# EAGLE design AEMBLINK-R1 (EAGLE 9.3.2)
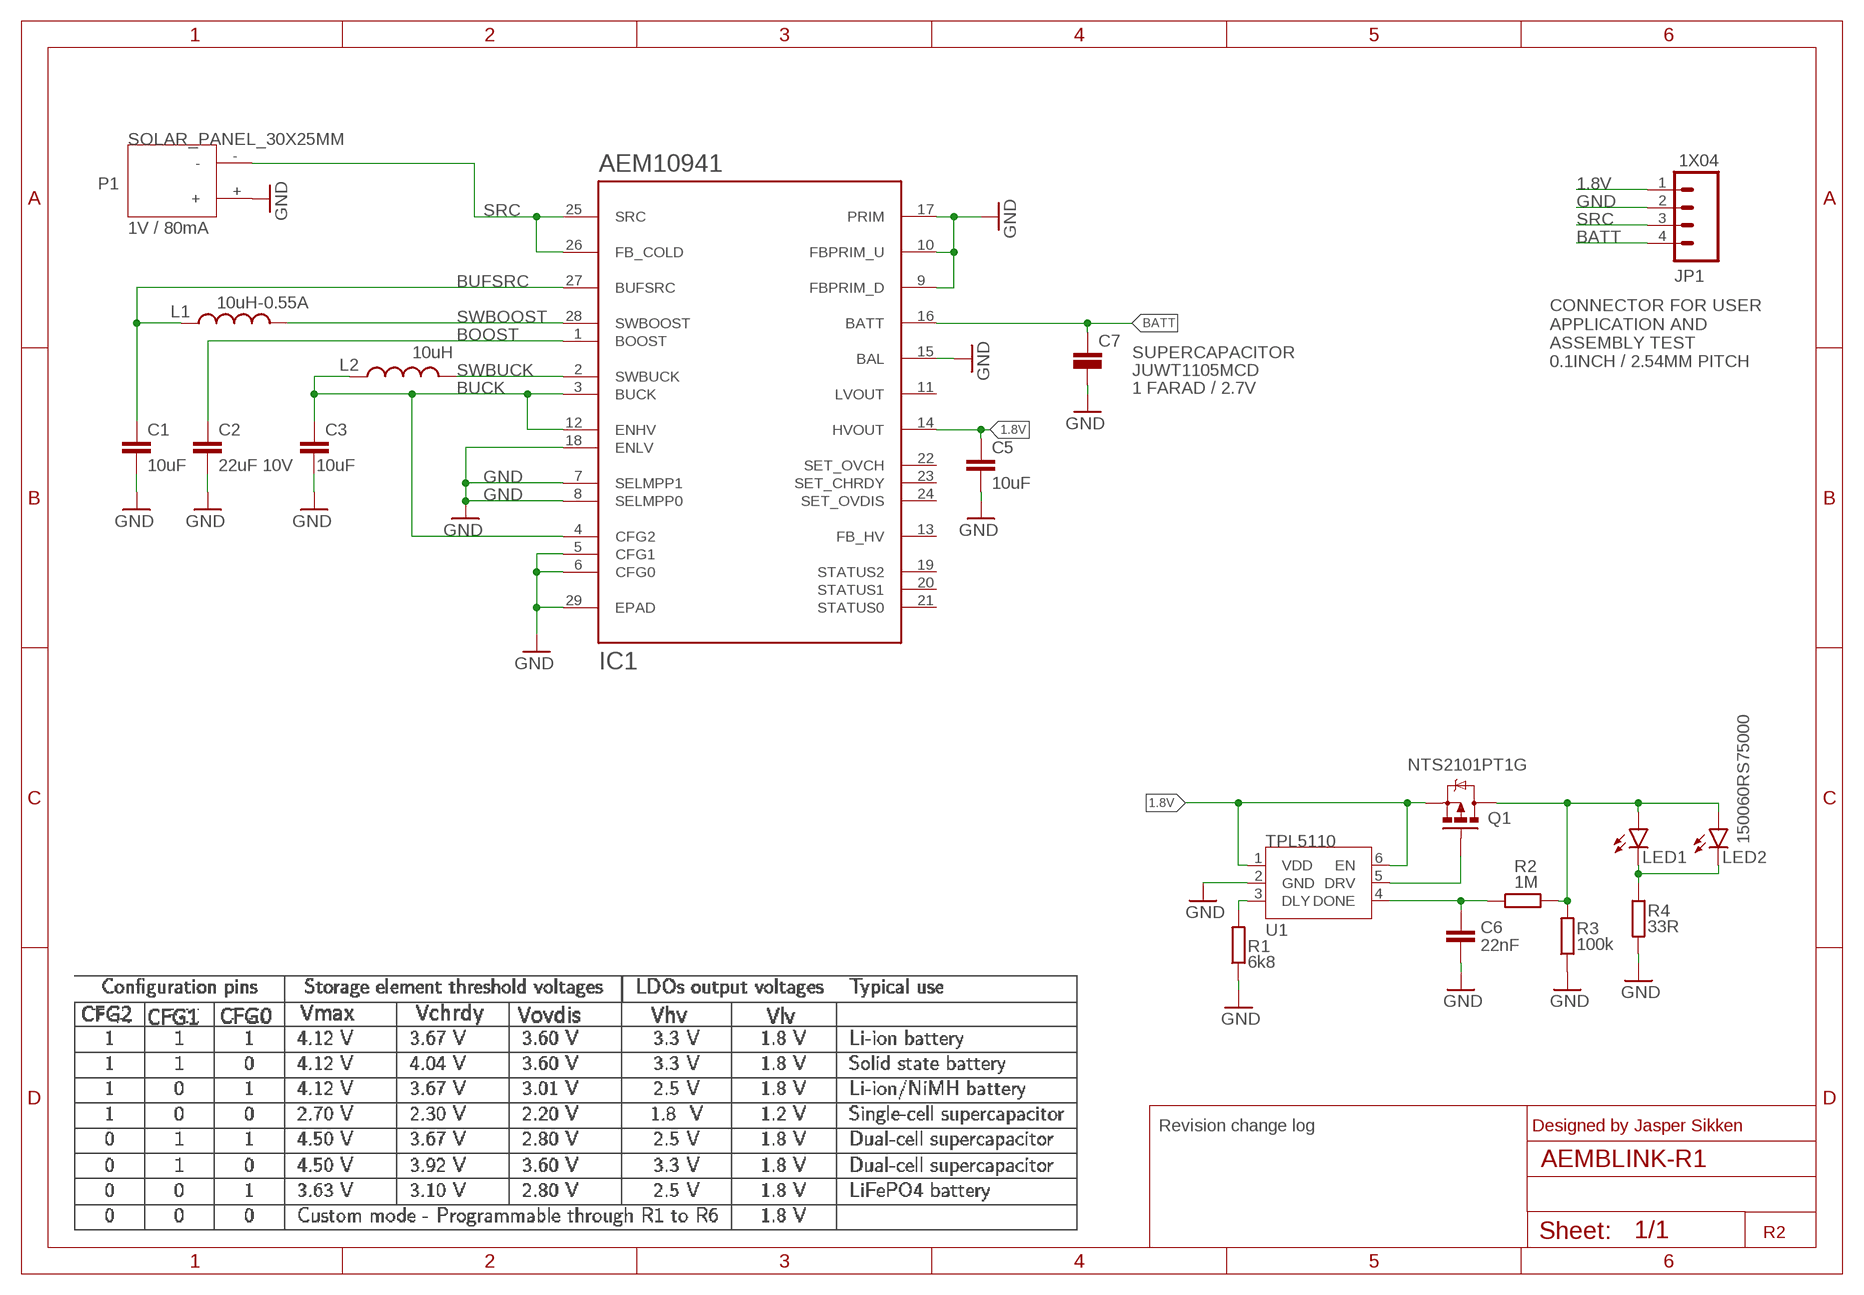
[diagram p0: schematic, sheet 1]

## Parts
C1  10uF  C0603_10UF  [C0603]
C2  22uF 10V  C0603_22UF  [C0603]
C3  10uF  C0603_10UF  [C0603]
C5  10uF  C0603_10UF  [C0603]
C6  22nF  C0603_10NF  [C0603]
C7  JUWT1105MCD  SUPERCAPNICHICON  [C_RADIAL_9L6.3D2.5P0.5H_HOR]
IC1  AEM10941  [QFN50P505X505X90-28]
JP1  1X04  [1X04_2.54MM_ROUND_NOSILK]
L1  10uH-0.55A  L3.9X3.9_10UH_0.55A  [LPS4012]
L2  10uH  L0603_10UH  [L0603]
LED1  LEDCHIPLED_0603  [CHIPLED_0603]
LED2  150060RS75000  LEDCHIPLED_0603  [CHIPLED_0603]
P1  SOLAR_PANEL_30X25MM  [SOLAR_PANEL_30X25]
Q1  NTS2101PT1G  MOSFET-P-CHANNEL-DMP2160UW  [SOT323]
R1  6k8  R-EU_R0603  [R0603]
R2  1M  R0603_1M  [R0603]
R3  100k  R0603_1M  [R0603]
R4  33R  R-EU_R0603  [R0603]
U1  TPL5110  [SOT23-6]

## Nets
1.8V: C5.1 IC1.14(HVOUT) JP1.1 Q1.2(S) U1.1(VDD) U1.6(EN)
BATT: C7.+ IC1.16(BATT) JP1.4
BOOST: C2.1 IC1.1(BOOST)
BUCK: C3.1 IC1.3(BUCK) IC1.4(CFG2) IC1.12(ENHV) L2.1
BUFSRC: C1.1 IC1.27(BUFSRC) L1.1
DELAY: R1.2 U1.3(DLY)
DONE: C6.1 R2.1 U1.4(DONE)
DRIVE: Q1.1(G) U1.5(DRV)
GND: C1.2 C2.2 C3.2 C5.2 C6.2 C7.- IC1.5(CFG1) IC1.6(CFG0) IC1.7(SELMPP1) IC1.8(SELMPP0) IC1.9(FBPRIM_D) IC1.10(FBPRIM_U) IC1.15(BAL) IC1.17(PRIM) IC1.18(ENLV) IC1.29(EPAD) JP1.2 P1.+ R1.1 R3.1 R4.2 U1.2(GND)
LEDNET: LED1.C LED2.C R4.1
N$5: LED1.A LED2.A Q1.3(D) R2.2 R3.2
SRC: IC1.25(SRC) IC1.26(FB_COLD) JP1.3 P1.-
SWBOOST: IC1.28(SWBOOST) L1.2
SWBUCK: IC1.2(SWBUCK) L2.2
Unconnected: IC1.11(LVOUT) IC1.13(FB_HV) IC1.19(STATUS2) IC1.20(STATUS1) IC1.21(STATUS0) IC1.22(SET_OVCH) IC1.23(SET_CHRDY) IC1.24(SET_OVDIS)

## Notes on the sheet
- 1V / 80mA
- SUPERCAPACITOR
- CONNECTOR FOR USER 
  APPLICATION AND 
  ASSEMBLY TEST
  0.1INCH / 2.54MM PITCH
- 1 FARAD / 2.7V
- Revision change log | Designed by Jasper Sikken
- R2

## Library data of the parts
C1 C3 C5 = TSEM:C: Non-polarized capacitor; FARNELL_OC: 2113070; MF: Taiyo Yuden; MPN: LMK107BBJ106MALT
C2 = TSEM:C: Non-polarized capacitor; FARNELL_OC: 2426957; MF: Murata; MPN: GRM188R61A226ME15D
C6 = TSEM:C: Non-polarized capacitor; FARNELL_OC: 3019561
C7 = TSEM:SUPERCAP
IC1 = TSEM:AEM10941: Ambient Energy Manager from e-peas; MF: e-peas; MPN: AEM10941
JP1 = TSEM:1X04
L1 = TSEM:L: Inductor; FARNELL_OC: 2408076; MF: Coilcraft; MPN: LPS4012-103MRB
L2 = TSEM:L: Inductor; FARNELL_OC: 2215635; MF: TDK; MPN: MLZ1608M100WT
LED1 LED2 = led:LED: LED OSRAM: - CHIPLED LG R971, LG N971, LY N971, LG Q971, LY Q971, LO R971, LY R971 LH N974, LH R974 LS Q976, LO Q976, LY Q976 LO Q996 - Hyper CHIPLED LW Q18S LB Q993, LB Q99A, LB R99A - SideLED LS A670, LO A670, LY A670, LG A670, LP A670 LB A673, LV A673, LT A673, LW A673 LH A674 LY A675 LS A676, LA A676, LO A676, LY A676, LW A676 LS A679, LY A679, LG A679 - Hyper Micro SIDELED® LS Y876, LA Y876, LO Y876, LY Y876 LT Y87S - SmartLED LW L88C, LW L88S LB L89C, LB L89S, LG L890 LS L89K, LO L89K, LY L89K LS L896, LA L896, LO L896, LY L896 - TOPLED LS T670, LO T670, LY T670, LG T670, LP T670 LSG T670, LSP T670, LSY T670, LOP T670, LYG T670 LG T671, LOG T671, LSG T671 LB T673, LV T673, LT T673, LW T673 LH T674 LS T676, LA T676, LO T676, LY T676, LB T676, LH T676, LSB T676, LW T676 LB T67C, LV T67C, LT T67C, LS T67K, LO T67K, LY T67K, LW E67C LS E67B, LA E67B, LO E67B, LY E67B, LB E67C, LV E67C, LT E67C LW T67C LS T679, LY T679, LG T679 LS T770, LO T770, LY T770, LG T770, LP T770 LB T773, LV T773, LT T773, LW T773 LH T774 LS E675, LA E675, LY E675, LS T675 LS T776, LA T776, LO T776, LY T776, LB T776 LHGB T686 LT T68C, LB T68C - Hyper Mini TOPLED® LB M676 - Mini TOPLED Santana® LG M470 LS M47K, LO M47K, LY M47K Source: http://www.osram.convergy.de LUXEON: - LUMILED® LXK2-PW12-R00, LXK2-PW12-S00, LXK2-PW14-U00, LXK2-PW14-V00 LXK2-PM12-R00, LXK2-PM12-S00, LXK2-PM14-U00 LXK2-PE12-Q00, LXK2-PE12-R00, LXK2-PE12-S00, LXK2-PE14-T00, LXK2-PE14-U00 LXK2-PB12-K00, LXK2-PB12-L00, LXK2-PB12-M00, LXK2-PB14-N00, LXK2-PB14-P00, LXK2-PB14-Q00 LXK2-PR12-L00, LXK2-PR12-M00, LXK2-PR14-Q00, LXK2-PR14-R00 LXK2-PD12-Q00, LXK2-PD12-R00, LXK2-PD12-S00 LXK2-PH12-R00, LXK2-PH12-S00 LXK2-PL12-P00, LXK2-PL12-Q00, LXK2-PL12-R00 Source: www.luxeon.com KINGBRIGHT: KA-3528ASYC Source: www.kingbright.com
P1 = TSEM:SOLAR_PANEL_30X25MM
Q1 = TSEM:MOSFET-P-CHANNEL: MOSFET P Channel; FARNELL_OC: 1858672
R1 R4 = rcl:R-EU_: RESISTOR, European symbol; SPICEPREFIX: R
R2 = TSEM:R: Resistor; FARNELL_OC: 2447285
R3 = TSEM:R: Resistor; FARNELL_OC: 2447285; VALUE: 1M
U1 = TSEM:TPL5110: TPL5110 Nano-Power System Timer for Power Gating SOT23 (6) 3.00 mm × 3.00 mm

## Board
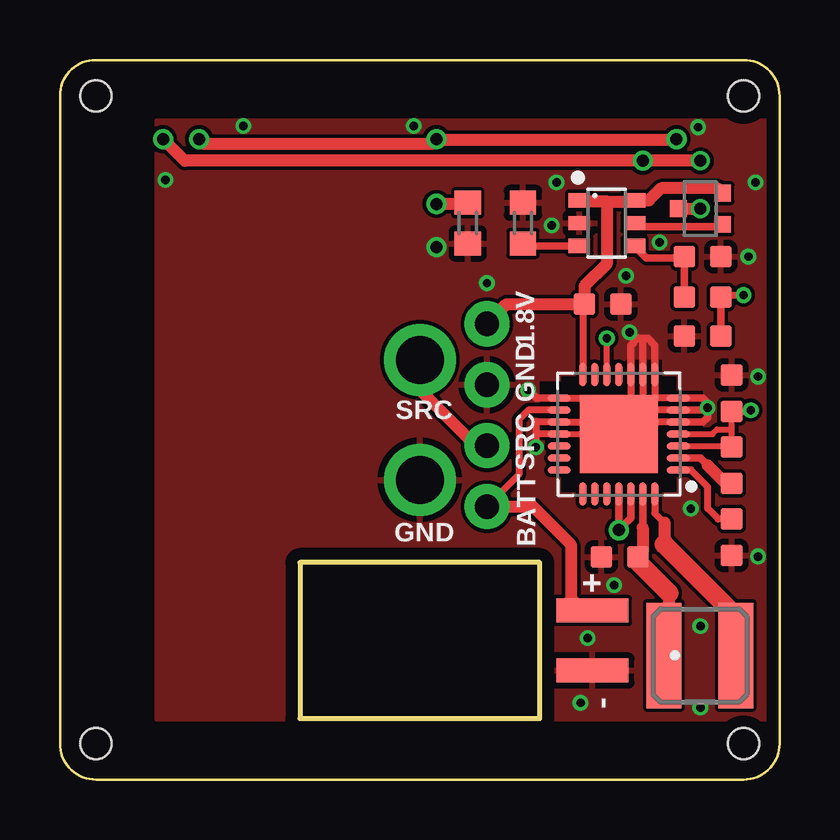
[diagram p1: board, top side]
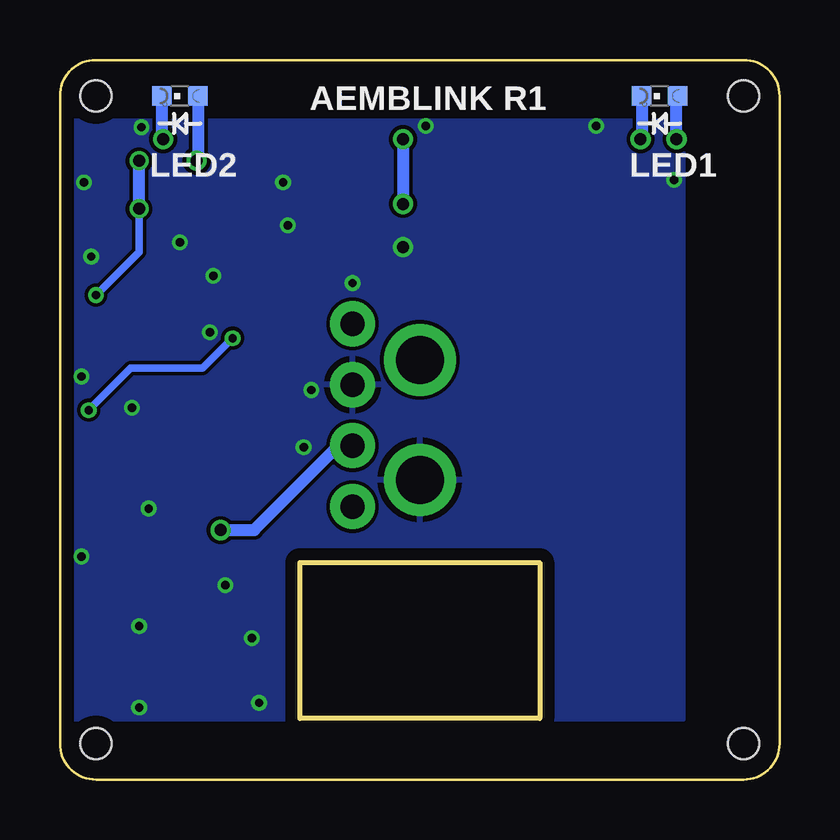
[diagram p2: board, bottom side, seen from below]

Size 30 x 30 mm. Coordinates in mm from the lower left corner, seen from the top.
Outline: 1.5,30 9,30 21,30 28.5,30 arc-90 30,28.5 30,1.5 arc-90 28.5,0 1.5,0 arc-90 0,1.5 0,28.5 arc-90 1.5,30
Copper layers (1*16): Top 0.035mm / dielectric 1.6mm / Bottom 0.035mm
Design rules "Elecrow_2-layer_PCB_eagle_rule *": minimum track width 6mil, minimum drill 12mil, track to track 0.15mm, track to pad 0.15mm, pad to pad 0.15mm, via to via 0.15mm, smd to smd 0mil, copper to edge 20mil, drill to drill 10mil, minimum pad ring 6mil, minimum via ring 6mil, stop-mask expansion 0.05mm, vias tented up to drill 100mil, thermal gap 10mil
Holes 1.3 mm at 1.5,28.5 28.5,28.5 1.5,1.5 28.5,1.5
tRestrict: area 23.6,16.5 to 25.1,17.5; area 25.4,14.7 to 26.8,16.2; area 20,15.7 to 21.3,16.6; area 19.9,14.2 to 21.1,15.1

### Footprints (pad centres in the part's own frame; a part is rotated, then mirrored left to right if it is on the bottom)
C0603 = smd 0.889 x 0.889: 1 -0.762,0; 2 0.762,0
C_RADIAL_9L6.3D2.5P0.5H_HOR = smd 1 x 3: + -1.25,7.2; - 1.25,7.2
QFN50P505X505X90-28 = smd 0.977 x 0.292: 1 -2.486,1.5; 2 -2.486,1; 3 -2.486,0.5; 4 -2.486,0; 5 -2.486,-0.5; 6 -2.486,-1; 7 -2.486,-1.5; 15 2.486,-1.5; 16 2.486,-1; 17 2.486,-0.5; 18 2.486,0; 19 2.486,0.5; 20 2.486,1; 21 2.486,1.5 | smd 0.292 x 0.977: 8 -1.5,-2.486; 9 -1,-2.486; 10 -0.5,-2.486; 11 0,-2.486; 12 0.5,-2.486; 13 1,-2.486; 14 1.5,-2.486; 22 1.5,2.486; 23 1,2.486; 24 0.5,2.486; 25 0,2.486; 26 -0.5,2.486; 27 -1,2.486; 28 -1.5,2.486 | smd 3.25 x 3.25: 29 0,0
1X04_2.54MM_ROUND_NOSILK = drill 1.016 pad 1.88: 1 0,0; 2 2.54,0; 3 5.08,0; 4 7.62,0
LPS4012 = smd 1.45 x 4.4: 1 -1.5,0; 2 1.5,0
L0603 = smd 0.889 x 0.889: 1 -0.762,0; 2 0.762,0
CHIPLED_0603 = smd 0.8 x 0.8: A 0,-0.75; C 0,0.75
SOLAR_PANEL_30X25 = drill 2 pad 3: + -2.5,0; - 2.5,0
SOT323 = smd 0.7 x 0.7: 1 -0.65,-0.925; 2 0.65,-0.925; 3 0,0.925
R0603 = smd 1 x 1.1: 1 -0.85,0; 2 0.85,0
R0603' = smd 0.889 x 0.889: 1 -0.762,0; 2 0.762,0
SOT23-6 = smd 0.6 x 0.9: 1 -0.95,-1.15; 2 0,-1.15; 3 0.95,-1.15; 4 0.95,1.15; 5 0,1.15; 6 -0.95,1.15

### Placement (x,y rotation side)
C1  23.33,9.28 180 top
C2  28,10.1 270 top
C3  28,16.1 90 top
C5  22.63,19.82 0 top
C6  26.8,21.8 0 top
C7  15,5.8 270 top
IC1  23.3,14.4 180 top
JP1  17.8,19 270 top
L1  26.68,5.17 0 top
L2  28,13.1 270 top
LED1  5,28.5 90 bottom
LED2  25,28.5 90 bottom
P1  15,15 90 top
Q1  26.7,23.8 90 top
R1  19.3,23.2 270 top
R2  1M  [R0603']  26.8,20.12 0 top
R3  100k  [R0603']  26.8,18.5 0 top
R4  17,23.2 270 top
U1  22.8,23.2 270 top

### Tracks (layer width: path | path; a pad name or v marks a point on that pad's centre or on a via)
1.8V
  Top 0.3: C5.1 21.8,19.75 IC1.14
  Top 0.305: 21.5,24.2 21.6,24.2 U1.1
  Top 0.5: 22.8,24.1 22.8,21.5 21.87,20.57 C5.1 18.62,19.82 JP1.1 | 22.8,24.1 23.9,24.1 U1.6 24.56,24.15 25.06,24.65 27.42,24.65 Q1.2 | 22.8,24.1 21.6,24.1 21.5,24.2
BATT
  Top 0.3: IC1.16 19.53,15.4 19.13,15 19.13,12.71 JP1.4 | 21.8,7.05 C7.+
  Top 0.5: JP1.4 19.72,11.38 21.3,9.8 21.3,7.55 21.8,7.05
BOOST
  Top 0.3: C2.1 27.44,10.86 27,11.3 27,12.2 26.3,12.9
  Top 0.305: 26.3,12.9 IC1.1
BUCK  (via drill 0.35)
  Top 0.254: IC1.12 v22.8,18.4 | L2.1 28,14.6 | 28,14.6 C3.1 | IC1.4 27.2,14.4 27.4,14.6 28,14.6 | IC1.3 27.96,13.9
  Top 0.305: 27.96,13.9 L2.1 | C3.1 28.74,15.34 v28.8,15.4
  Bottom 0.305: v28.8,15.4 27.05,17.15 24.05,17.15 v22.8,18.4
BUFSRC
  Top 0.305: IC1.27 24.3,10.5
  Top 0.508: 24.3,10.5 24.3,9.48 C1.1 24.1,9.07 | 25.4,7.78 25.4,5.39 L1.1
  Top 0.8: 25.4,7.78 24.1,9.07
DELAY
  Top 0.305: U1.3 19.4,22.25 R1.2
DONE
  Top 0.305: U1.4 24.45,21.75 25.99,21.75 C6.1 R2.1
DRIVE
  Top 0.305: U1.5 24.1,23.05 27.52,23.05 Q1.1
GND  (via drill 0.35, 0.5 pad 0.85)
  Top 0.254: IC1.18 23.2,14.4
  Top 0.3: IC1.5 24.9,14.9 24.3,14.3 23.4,14.3 IC1.29 | IC1.6 24.3,15.4 | IC1.7 24.8,15.9 | 24.8,15.9 24.3,15.4 | IC1.8 24.8,15.9 | IC1.9 24.3,15.4 | 24.3,15.4 23.8,14.9 | IC1.10 23.8,14.9 | IC1.29 23.2,14.4 22.7,14.9 IC1.17 19.86,14.9 19.84,14.92 19.84,14.37 | IC1.29 23.5,14.6 | 23.5,14.6 23.8,14.9 | IC1.15 22.2,15.9 23.5,14.6 | IC1.18 19.87,14.4 19.84,14.37 | 19.84,14.37 v19.84,13.85
  Top 0.305: IC1.5 26.8,14.9 27,15.1 v27,15.5 | IC1.6 26.9,15.4 v27,15.5 | IC1.7 26.8,15.9 27,15.7 v27,15.5 | IC1.10 23.8,18.1 24.1,18.4 24.3,18.4 | IC1.9 24.3,18.4 | IC1.8 24.8,18.1 24.5,18.4 24.3,18.4 | IC1.15 19.86,15.9 v19.52,16.24
  other vias: 26.7,6.4 29.1,16.8 23.1,8.1 26.3,11.3 29.1,9.3 28.7,21.8 22,5.9 26.7,3 21.7,3.2 20.5,23.1 17.8,20.7 15.7,22.2 20.7,24.9 25,22.4 4.4,25 7.65,27.25 14.75,27.25 26.6,27.2 29,24.9 23.75,18.65 23.6,21
  pour Top: 4,27.5 30.1,27.5 30.1,2.5 4,2.5
  pour Bottom (rank 2): 4,27.5 4,2.5 30.1,2.5 30.1,27.5
LEDNET  (via drill 0.5 pad 0.85)
  Top 0.305: R4.1 17,24
  Top 0.5: v5.8,26.7 6,26.5 15.5,26.5 v15.7,26.7 15.75,26.65 25.65,26.65 v25.7,26.7 | 17,24 v15.7,24
  Bottom 0.305: 5.75,26.75 v5.8,26.7 | v25.7,26.7 25.75,26.75
  Bottom 0.5: LED1.C 5.75,26.75 | 25.75,26.75 LED2.C | v15.7,26.7 v15.7,24
N$5  (via drill 0.35, 0.5, 0.5 pad 0.85)
  Top 0.3: 27.67,20.2 v28.5,20.2
  Top 0.305: R3.2 R2.2 27.64,20.2 27.67,20.2
  Top 0.5: v4.3,26.7 5.2,25.8 v24.3,25.8 v26.7,25.8 | Q1.3 v26.7,23.8
  Bottom 0.305: v26.7,23.8 26.7,22 v28.5,20.2 | 4.3,28.45 LED1.A | 24.25,25.85 v24.3,25.8
  Bottom 0.5: v4.3,26.7 4.3,28.45 | LED2.A 24.25,25.85 | v26.7,23.8 v26.7,25.8
SRC  (via drill 0.5 pad 0.85)
  Top 0.305: IC1.25 v23.3,10.4 23.8,10.9 IC1.26
  Top 0.5: P1.- 15,16.25 17.33,13.92 JP1.3
  Bottom 0.5: v23.3,10.4 21.9,10.4 18.38,13.92 JP1.3
SWBOOST
  Top 0.3: IC1.28 24.8,11.1 25.2,10.7
  Top 0.508: 25.2,10.7 25.2,9.8
  Top 0.813: L1.2 28.18,6.82 25.2,9.8
SWBUCK
  Top 0.305: IC1.2 26.7,13.4 27,13.1
  Top 0.508: 27,13.1 27.76,12.34 L2.2

### Text on the board
tPlace: 1.8V | GND | SRC | SRC | GND | BATT
bPlace: AEMBLINK R1